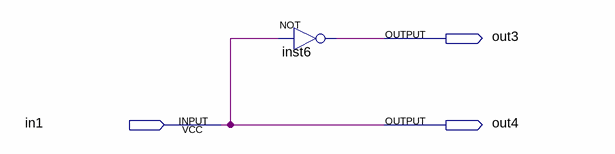
[diagram p0: schematic sheet]
// Quartus schematic decoder1_2.bdf as structural Verilog: 1 symbols, 3 pins
module decoder1_2 (
  input  in1,
  output out3,
  output out4
);

  not inst6 (out3, in1);

  assign out4 = in1;
endmodule
